# EAGLE schematic light detector v2.3 (EAGLE 9.6.2)
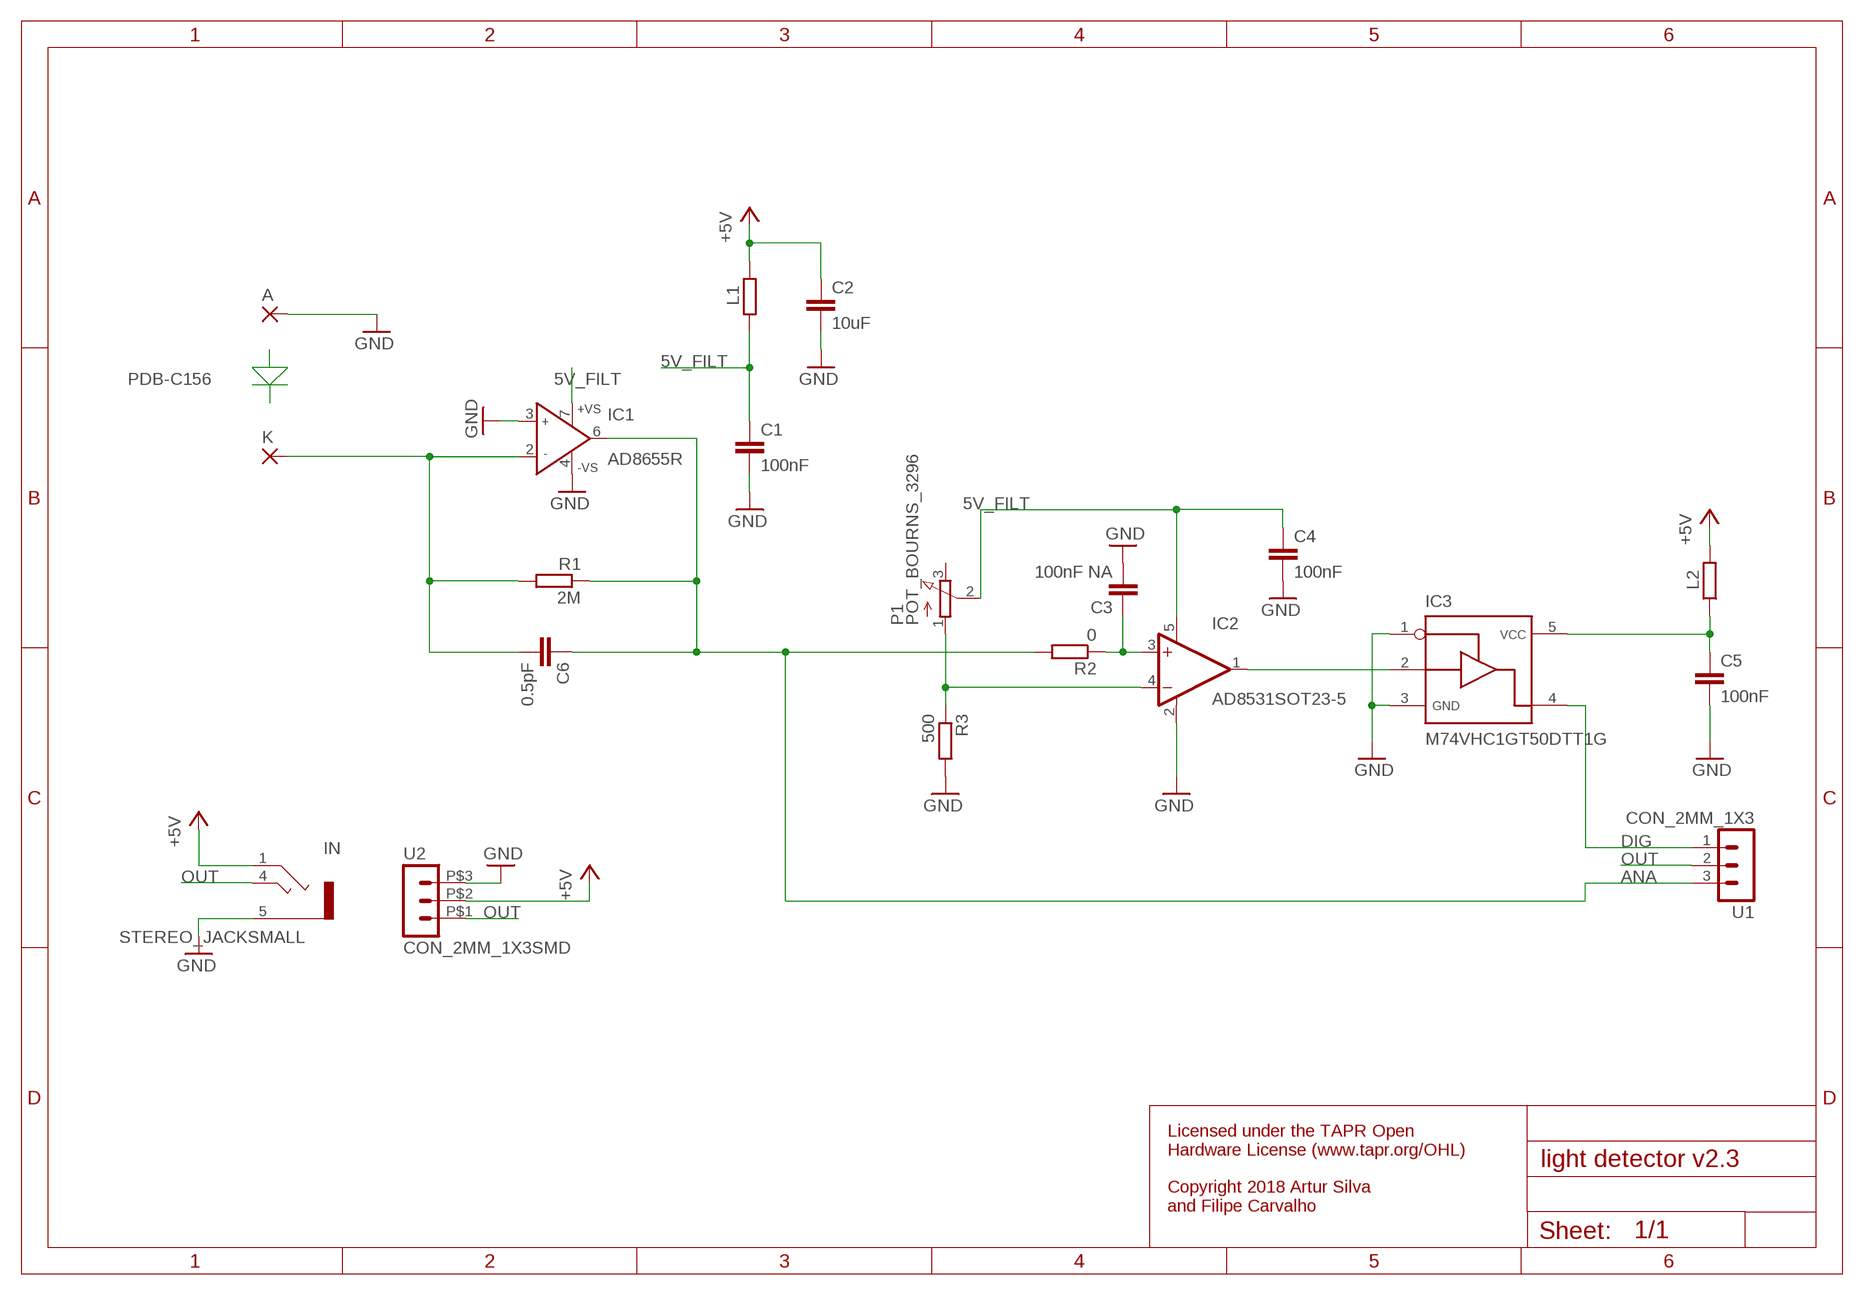
[diagram p0: schematic, sheet 1]

## Parts
A  1,6/0,8  [1,6/0,8]
C1  100nF  C-EUC0402  [C0402]
C2  10uF  C-EUC0603  [C0603]
C3  100nF NA  C-EUC0402  [C0402]
C4  100nF  C-EUC0402  [C0402]
C5  100nF  C-EUC0402  [C0402]
C6  0.5pF  C-EUC0402  [C0402]
IC1  AD8655R  [SO8]
IC2  AD8531SOT23-5  [SOT23-5]
IC3  M74VHC1GT50DTT1G  SN74LVC1G125  [SOT23-5]
IN  STEREO_JACKSMALL  [35RASMT2BHNTRX_]
K  1,6/0,8  [1,6/0,8]
L1  1k@100M  R-EU_R0402  [R0402]
L2  1k@100M  R-EU_R0402  [R0402]
P1  POT_BOURNS_3296  [POT_BOURNS_3296P]
R1  2M  R-EU_R0402  [R0402]
R2  0  R-EU_R0402  [R0402]
R3  500  R-EU_R0402  [R0402]
U1  CON_2MM_1X3  [CON_2MM_1X3]
U2  CON_2MM_1X3SMD  [CON_2MM_1X3_SMD]

## Nets
5V_FILT: C1.1 C4.1 IC1.7(+VS) IC2.5(V+) L1.2 P1.2(S)
+5V: C2.1 IN.1 L1.1 L2.2 U2.P$2
ANA: C6.1 IC1.6(OUT) R1.1 R2.2 U1.3
DIG: IC3.4 U1.1
GND: A.1(P) C1.2 C2.2 C3.2 C4.2 C5.2 IC1.3(IN+) IC1.4(-VS) IC2.2(V-) IC3.1 IC3.3 IN.5 R3.2 U2.P$3
IN2: IC2.4(-IN) P1.1(A) R3.1
N$2: C6.2 IC1.2(IN-) K.1(P) R1.2
N$6: C3.1 IC2.3(+IN) R2.1
N$7: IC2.1(OUT) IC3.2
N$8: C5.1 IC3.5 L2.1
OUT: IN.4 U1.2 U2.P$1
Unconnected: P1.3(E)

## Notes on the sheet
- PDB-C156
- Licensed under the TAPR Open 
  Hardware License (www.tapr.org/OHL)
  
  Copyright 2018 Artur Silva 
  and Filipe Carvalho

## Library data of the parts
A K = wirepad:1,6/0,8: THROUGH-HOLE PAD
C1-C6 = rcl:C-EU: CAPACITOR, European symbol
IC1 = analog-devices:AD8655: Low Noise, Precision CMOS Amplifier Source: http://www.analog.com/static/imported-files/data_sheets/AD8655_8656.pdf; MF: ALTERA CORPORATION; MPN: AD8655ARMZ-REEL; OC_FARNELL: 1078267; OC_NEWARK: 59K7050
IC2 = CNP-ics 1:AD8531
IC3 = My_library 0v2:SN74LVC1G125
IN = CNP-connectors:STEREO_JACK
L1 L2 R1-R3 = rcl:R-EU_: RESISTOR, European symbol
P1 = CNP-miscellaneous:POT_BOURNS_3296
U1 U2 = CNP-connectors:CON_2MM_1X3